# EAGLE schematic motor ic (EAGLE 6.5.0)
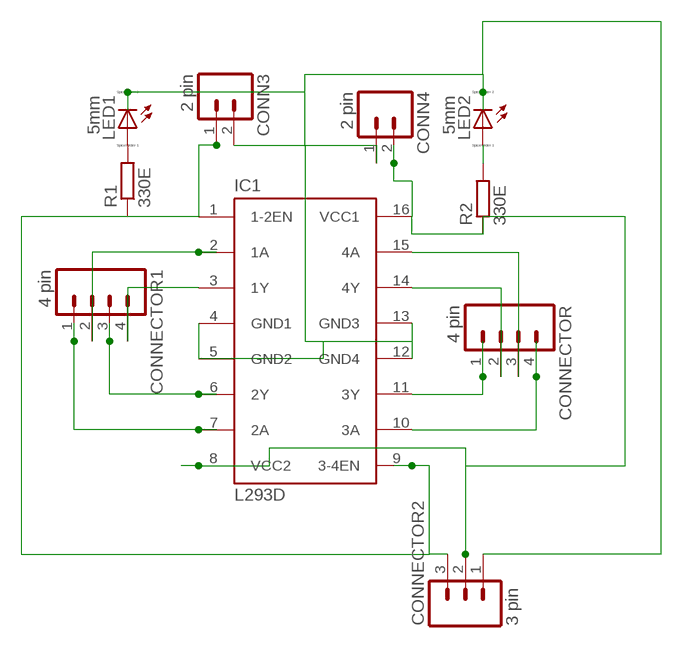
[diagram p0: schematic, sheet 1]

## Parts
CONN3  2 pin  M02  [02P]
CONN4  2 pin  M02  [02P]
CONNECTOR  4 pin  M04  [04P]
CONNECTOR1  4 pin  M04  [04P]
CONNECTOR2  3 pin  M03  [03P]
IC1  L293D  [DIL16]
LED1  5mm  LED_ELD260  [LED_LD260]
LED2  5mm  LED_ELD260  [LED_LD260]
R1  330E  R-EU_0204/7  [0204/7]
R2  330E  R-EU_0204/7  [0204/7]

## Nets
N$1: LED1.A R1.2
N$2: LED2.A R2.2
N$4: CONNECTOR1.2 IC1.2(1A)
N$5: CONNECTOR1.4 IC1.3(1Y)
N$6: CONNECTOR1.3 IC1.6(2Y)
N$7: CONNECTOR1.1 IC1.7(2A)
N$8: CONNECTOR.3 IC1.15(4A)
N$9: CONNECTOR.4 IC1.10(3A)
N$10: CONNECTOR.2 IC1.14(4Y)
N$11: CONNECTOR.1 IC1.11(3Y)
N$12: CONN3.2 CONN4.1 CONNECTOR2.1 IC1.4(GND1) IC1.5(GND2) IC1.12(GND4) IC1.13(GND3) LED1.K(C) LED2.K(C)
N$13: CONN3.1 CONNECTOR2.3 IC1.1(1-2EN) IC1.9(3-4EN) R1.1
N$14: CONN4.2 CONNECTOR2.2 IC1.8(VCC2) IC1.16(VCC1) R2.1

## Library data of the parts
CONN3 CONN4 = con-amp-quick:M02: AMP QUICK CONNECTOR; OC_FARNELL: unknown; OC_NEWARK: unknown
CONNECTOR CONNECTOR1 = con-amp-quick:M04: AMP QUICK CONNECTOR; OC_FARNELL: unknown; OC_NEWARK: unknown
CONNECTOR2 = con-amp-quick:M03: AMP QUICK CONNECTOR; OC_FARNELL: unknown; OC_NEWARK: unknown
IC1 = st-microelectronics:L293D: PUSH-PULL 4 CHANNEL DRIVER; MPN: L293D; OC_FARNELL: 9589619; OC_NEWARK: 56P8249
LED1 LED2 = eagle-ltspice:LED_E: LED Source: http://www.osram.convergy.de Source: www.luxeon.com Source: www.kingbright.com; SPICEMODEL: NONE; SPICEPREFIX: D; SPICETYPE: diode
R1 R2 = rcl:R-EU_: RESISTOR, European symbol